# EAGLE design electrode (EAGLE 8.1.1)
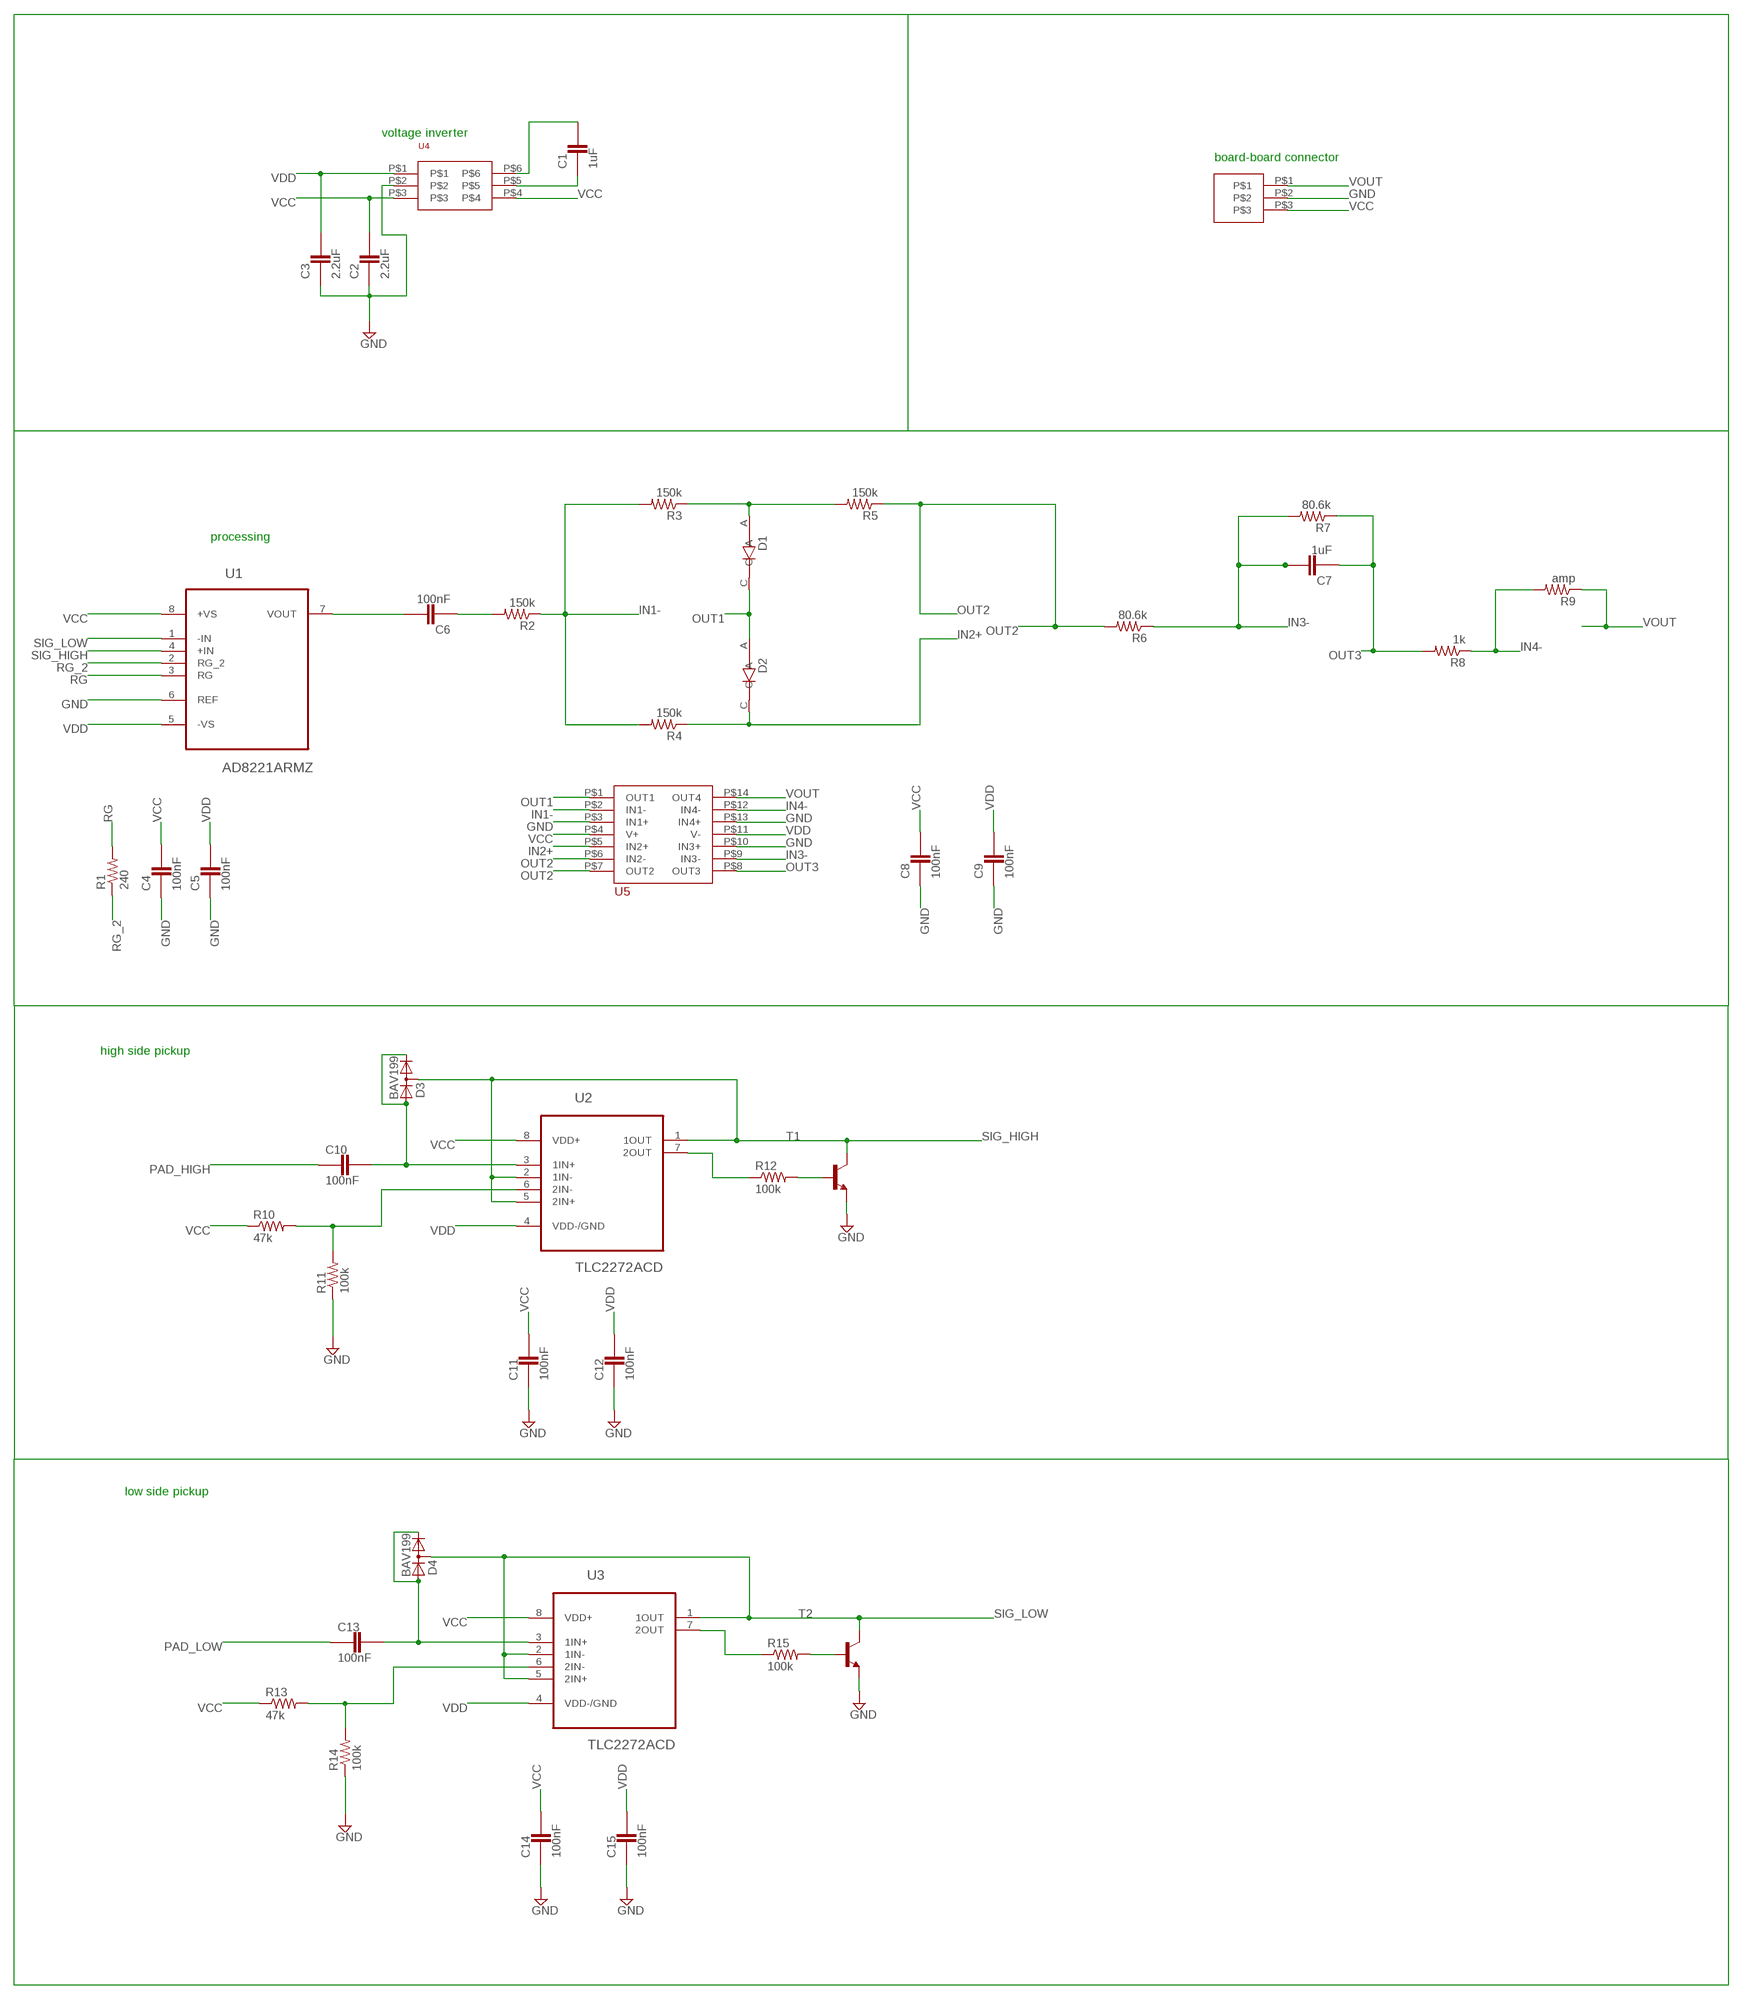
[diagram p0: schematic, sheet 1]

## Parts
C1  1uF  C0603C100C5GACTU  [C0603C100C5GACTU_CAPC1608X90]
C2  2.2uF  C0603C100C5GACTU  [C0603C100C5GACTU_CAPC1608X90]
C3  2.2uF  C0603C100C5GACTU  [C0603C100C5GACTU_CAPC1608X90]
C4  100nF  C0603C100C5GACTU  [C0603C100C5GACTU_CAPC1608X90]
C5  100nF  C0603C100C5GACTU  [C0603C100C5GACTU_CAPC1608X90]
C6  100nF  C0603C100C5GACTU  [C0603C100C5GACTU_CAPC1608X90]
C7  1uF  C0603C100C5GACTU  [C0603C100C5GACTU_CAPC1608X90]
C8  100nF  C0603C100C5GACTU  [C0603C100C5GACTU_CAPC1608X90]
C9  100nF  C0603C100C5GACTU  [C0603C100C5GACTU_CAPC1608X90]
C10  100nF  C0603C100C5GACTU  [C0603C100C5GACTU_CAPC1608X90]
C11  100nF  C0603C100C5GACTU  [C0603C100C5GACTU_CAPC1608X90]
C12  100nF  C0603C100C5GACTU  [C0603C100C5GACTU_CAPC1608X90]
C13  100nF  C0603C100C5GACTU  [C0603C100C5GACTU_CAPC1608X90]
C14  100nF  C0603C100C5GACTU  [C0603C100C5GACTU_CAPC1608X90]
C15  100nF  C0603C100C5GACTU  [C0603C100C5GACTU_CAPC1608X90]
D1  1N4148WS-7-F  [SOD2513X120N]
D2  1N4148WS-7-F  [SOD2513X120N]
D3  BAV199  [SOT23]
D4  BAV199  [SOT23]
R1  240  R-US_R0603  [R0603]
R2  150k  R-US_R0603  [R0603]
R3  150k  R-US_R0603  [R0603]
R4  150k  R-US_R0603  [R0603]
R5  150k  R-US_R0603  [R0603]
R6  80.6k  R-US_R0603  [R0603]
R7  80.6k  R-US_R0603  [R0603]
R8  1k  R-US_R0603  [R0603]
R9  amp  R-US_R0603  [R0603]
R10  47k  R-US_R0603  [R0603]
R11  100k  R-US_R0603  [R0603]
R12  100k  R-US_R0603  [R0603]
R13  47k  R-US_R0603  [R0603]
R14  100k  R-US_R0603  [R0603]
R15  100k  R-US_R0603  [R0603]
T1  MMBT2222ALT1-NPN-SOT23-BEC  [SOT23-BEC]
T2  MMBT2222ALT1-NPN-SOT23-BEC  [SOT23-BEC]
U1  AD8221ARMZ  [SOP65P490X110-8N]
U2  TLC2272ACD  [SOIC127P600X175-8N]
U3  TLC2272ACD  [SOIC127P600X175-8N]
U4  LM2776  [LM2776-SO]
U5  TL084  [TL084-TSSOP]
U$2  B3B-PH-SM4  [B3B-PH-SM4]

## Nets
CFLY+: C1.2 U4.P$5
CFLY-: C1.1 U4.P$6
GND: C2.2 C3.2 C4.2 C5.2 C8.2 C9.2 C11.2 C12.2 C14.2 C15.2 R11.1 R14.1 T1.E T2.E U1.6(REF) U4.P$2 U5.P$3(IN1+) U5.P$10(IN3+) U5.P$13(IN4+) U$2.P$2
IN1-: R2.1 R3.2 R4.2 U5.P$2(IN1-)
IN2+: D2.C R4.1 U5.P$5(IN2+)
IN3-: C7.1 R6.1 R7.2 U5.P$9(IN3-)
IN4-: R8.1 R9.2 U5.P$12(IN4-)
N$1: C6.1 U1.7(VOUT)
N$2: C6.2 R2.2
N$4: R13.2 R14.2 U3.6(2IN-)
N$5: D1.A R3.1 R5.2
N$6: C13.1 D4.1(A) D4.2(C) U3.3(1IN+)
N$7: R10.2 R11.2 U2.6(2IN-)
N$8: C10.1 D3.1(A) D3.2(C) U2.3(1IN+)
N$9: R12.1 U2.7(2OUT)
N$10: R12.2 T1.B
N$11: R15.1 U3.7(2OUT)
N$12: R15.2 T2.B
OUT1: D1.C D2.A U5.P$1(OUT1)
OUT2: R5.1 R6.2 U5.P$6(IN2-) U5.P$7(OUT2)
OUT3: C7.2 R7.1 R8.2 U5.P$8(OUT3)
PAD_HIGH: C10.2
PAD_LOW: C13.2
RG: R1.2 U1.3(RG)
RG_2: R1.1 U1.2(RG_2)
SIG_HIGH: D3.3(AC) T1.C U1.4(+IN) U2.1(1OUT) U2.2(1IN-) U2.5(2IN+)
SIG_LOW: D4.3(AC) T2.C U1.1(-IN) U3.1(1OUT) U3.2(1IN-) U3.5(2IN+)
VCC: C2.1 C4.1 C8.1 C11.1 C14.1 R10.1 R13.1 U1.8(+VS) U2.8(VDD+) U3.8(VDD+) U4.P$3 U4.P$4 U5.P$4(V+) U$2.P$3
VDD: C3.1 C5.1 C9.1 C12.1 C15.1 U1.5(-VS) U2.4(VDD-/GND) U3.4(VDD-/GND) U4.P$1 U5.P$11(V-)
VOUT: R9.1 U5.P$14(OUT4) U$2.P$1

## Notes on the sheet
- voltage inverter
- board-board connector
- processing
- high side pickup
- low side pickup

## Library data of the parts
C1-C15 = Common-Parts-Library-Eagle:C0603C100C5GACTU: Stock Cap 10pf 50v +/-0.25pf Np0(C0g) Smd-0603 Tr-7-Pa s; MANUFACTURER: KEMET
D1 D2 = Common-Parts-Library-Eagle:1N4148WS-7-F: 1N4148WS Series 2 A 75 V 200 mW Surface Mount Fast Switching Diode - SOD-323; MANUFACTURER: Diodes Inc.
D3 D4 = diode:BAV199: DIODE low-leakage double diode
R1-R15 = resistor:R-US_: RESISTOR, American symbol
T1 T2 = transistor:*-NPN-: NPN Transistror BF959 corrected 2008.03.06
U1 = AD8221ARMZ:AD8221ARMZ: Precision Instrumentation Amplifier; AVAILABILITY: Good; DESCRIPTION: Amplifier; Precision Instrumentation Amplifier, 8-Pin MSOP; MF: Analog Devices; MP: AD8221ARMZ; PACKAGE: MSOP-8 Analog Devices; PRICE: 3.99 USD
U2 U3 = TLC2272ACD:TLC2272ACD: OPERATIONAL AMPLIFIERS; AVAILABILITY: Good; DESCRIPTION: Advanced LinCMOS(TM) Rail-To-Rail Dual Operational Amplifier 8-SOIC; MF: Texas Instruments; MP: TLC2272ACD; PACKAGE: SOIC-8 Texas Instruments; PRICE: 1.29 USD
U4 = hands:LM2776
U5 = hands:TL084
U$2 = hands:B3B-PH-SM4

## Board
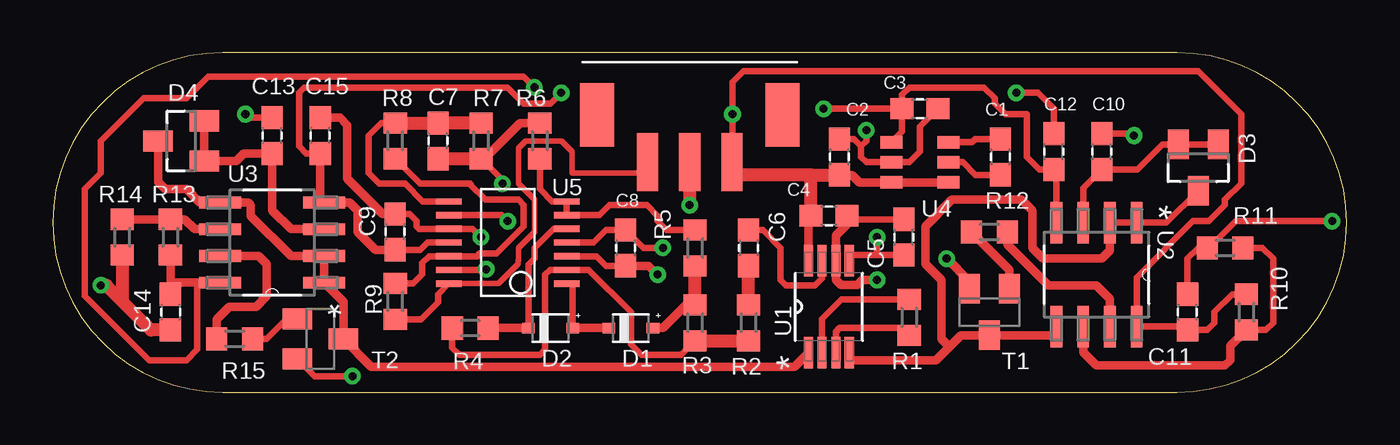
[diagram p1: board, top side]
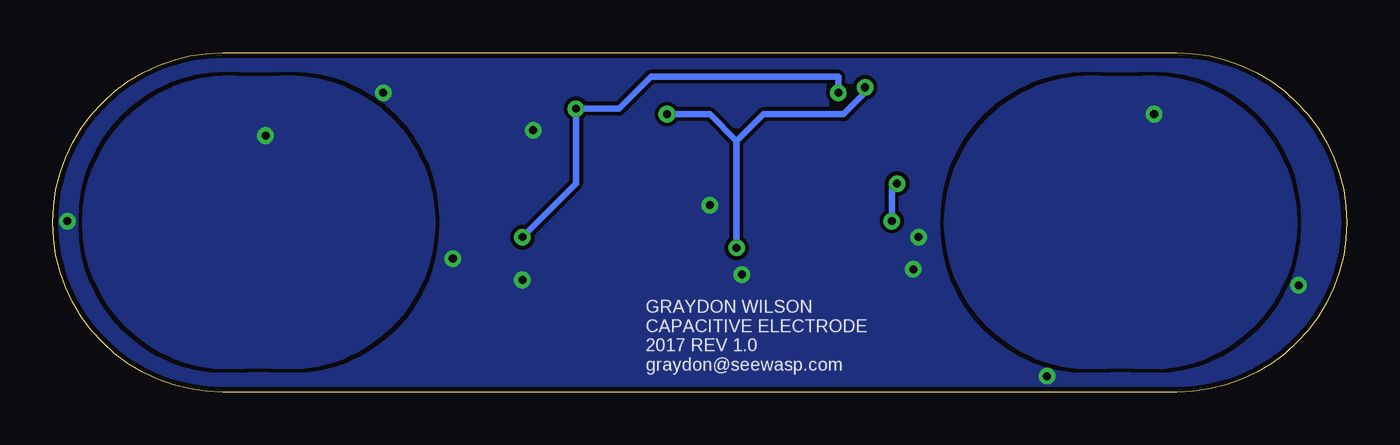
[diagram p2: board, bottom side, seen from below]

Size 61.4 x 16.13 mm. Coordinates in mm from the lower left corner, seen from the top.
Outline: 8.06,0 53.34,0 arc180 53.34,16.13 8.06,16.13 arc180 8.06,0
Copper layers (1*16): Top 0.035mm / dielectric 1.5mm / Bottom 0.035mm
Design rules "bac_student *": minimum track width 10mil, minimum drill 10mil, track to track 7mil, track to pad 7mil, pad to pad 7mil, via to via 7mil, smd to smd 7mil, copper to edge 10mil, drill to drill 8mil, minimum pad ring 10mil, minimum via ring 8mil, stop-mask expansion 4mil, vias tented up to drill 15mil, thermal gap 10mil

### Footprints (pad centres in the part's own frame; a part is rotated, then mirrored left to right if it is on the bottom)
C0603C100C5GACTU_CAPC1608X90 = smd 1.1 x 1: 1 -0.85,0; 2 0.85,0
SOD2513X120N = smd 0.6 x 0.5: A 1.05,0; C -1.05,0
SOT23 = smd 1 x 1.4: 1 -0.95,-1.1; 2 0.95,-1.1; 3 0,1.1
R0603 = smd 1 x 1.1: 1 -0.85,0; 2 0.85,0
SOT23-BEC = smd 1 x 1.4: B -0.95,-1.1; C 0,1.1; E 0.95,-1.1
SOP65P490X110-8N = smd 1.499 x 0.432: 1 -2.184,0.965; 2 -2.184,0.33; 3 -2.184,-0.33; 4 -2.184,-0.965; 5 2.184,-0.965; 6 2.184,-0.33; 7 2.184,0.33; 8 2.184,0.965
SOIC127P600X175-8N = smd 1.981 x 0.559: 1 -2.464,1.905; 2 -2.464,0.635; 3 -2.464,-0.635; 4 -2.464,-1.905; 5 2.464,-1.905; 6 2.464,-0.635; 7 2.464,0.635; 8 2.464,1.905
LM2776-SO = smd 1.05 x 0.6: P$1 -1.35,0.95; P$2 -1.35,0; P$3 -1.35,-0.95; P$4 1.35,-0.95; P$5 1.35,0; P$6 1.35,0.95
TL084-TSSOP = smd 0.3 x 1.2: P$1 -1.95,-2.8; P$2 -1.3,-2.8; P$3 -0.65,-2.8; P$4 0,-2.8; P$5 0.65,-2.8; P$6 1.3,-2.8; P$7 1.95,-2.8; P$8 1.95,2.8; P$9 1.3,2.8; P$10 0.65,2.8; P$11 0,2.8; P$12 -0.65,2.8; P$13 -1.3,2.8; P$14 -1.95,2.8
B3B-PH-SM4 = smd 1 x 2.75: P$1 -2,0; P$2 0,0; P$3 2,0 | smd 1.6 x 3: P$4 -4.4,2.25; P$5 4.4,2.25

### Placement (x,y rotation side)
C1  44.96,11.18 270 top
C2  37.34,11.18 90 top
C3  41.15,13.46 0 top
C4  36.83,8.38 0 top
C5  40.39,7.37 90 top
C6  33.02,6.86 270 top
C7  18.29,11.94 90 top
C8  27.18,6.86 270 top
C9  16.26,7.62 90 top
C10  49.78,11.43 90 top
C11  53.85,3.81 90 top
C12  47.5,11.43 90 top
C13  10.41,12.19 90 top
C14  5.59,3.81 270 top
C15  12.7,12.19 90 top
D1  27.43,3.05 0 top
D2  23.62,3.05 0 top
D3  54.36,10.67 180 top
D4  6.1,11.94 90 top
R1  40.64,3.56 270 top
R2  33.02,3.3 90 top
R3  30.48,3.3 270 top
R4  19.81,3.05 180 top
R5  30.48,6.86 270 top
R6  23.11,11.94 270 top
R7  20.32,11.94 270 top
R8  16.26,11.94 90 top
R9  16.26,4.32 90 top
R10  56.64,3.81 270 top
R11  55.63,6.86 0 top
R12  44.45,7.62 180 top
R13  5.59,7.37 90 top
R14  3.3,7.37 90 top
R15  8.64,2.54 0 top
T1  44.45,3.81 180 top
T2  12.7,2.54 270 top
U1  36.83,4.06 90 top
U2  49.53,5.59 270 top
U3  10.41,7.11 180 top
U4  41.15,10.92 0 top
U5  21.59,7.11 90 top
U$2  30.23,10.92 0 top

### Tracks (layer width: path | path; a pad name or v marks a point on that pad's centre or on a via)
CFLY+
  Top 0.305: U4.P$5 43.18,10.92 43.78,10.33 C1.2
CFLY-
  Top 0.305: C1.1 43.78,12.03 43.62,11.87 U4.P$6
GND  (via drill 0.38, 0.38 pad 0.61)
  Top 0.305: U5.P$3 25.8,6.46 26.25,6.01 C8.2 | C9.2 16.93,8.47 17.27,8.13 17.27,7.87 17.38,7.76 U5.P$10 19.92,7.76 v20.32,7.37 | U5.P$13 20.54,5.81 v20.57,5.84 | T2.E 12.43,0.76 v14.22,0.76 | C3.2 41.15,12.61 41.15,11.43 40.64,10.92 U4.P$2 38.61,10.92 38.35,11.18 38.35,11.68 | C2.2 38.01,12.03 38.35,11.68 | 38.61,12.19 v38.61,12.45 38.61,11.94 38.35,11.68 | C11.2 53.85,6.35 54.36,6.86 R11.1 54.86,6.86 56.13,8.13 v60.71,8.13 | C4.2 37.68,8.22 C5.2 | C12.2 47.5,13.46 46.74,14.22 v45.72,14.22
  Top 0.406: C4.2 37.68,7.96 37.16,7.44 U1.6 37.17,6.24 37.17,5.33 37.41,5.09 38.18,5.09 38.42,5.33 v39.12,5.33 | C9.2 15.66,8.47 13.97,10.16 13.97,12.7 13.63,13.04 C15.2 | C8.2 28.28,6.01 v28.7,5.59 | T1.E 43.5,5.27 v42.42,6.35
  Top 0.61: C14.2 4.66,2.96 3.3,4.32 | R14.1 3.3,4.32 | 3.3,4.32 2.54,5.08 v2.29,5.08 | U$2.P$2 v30.23,8.89
  pour Bottom (rank 2): -3.05,18.8 70.87,20.32 73.15,-5.59 -3.05,-6.1
IN1-
  Top 0.305: R4.2 18.96,2.12 19.3,1.78 23.11,1.78 23.37,2.03 23.37,5.59 23.59,5.81 U5.P$2 25.43,5.81 27.43,3.81 27.43,2.29 27.94,1.78 29.81,1.78 R3.2
  Top 0.61: R3.2 R2.1
IN2+
  Top 0.305: D2.C 22.57,6.06 22.86,6.35 22.86,6.86 23.76,7.76 U5.P$5
  Top 0.406: R4.1 D2.C
IN3-  (via drill 0.38)
  Top 0.305: U5.P$9 21.31,8.41 v21.59,8.13 | v21.34,9.91 21.34,10.07 R7.2
  Top 0.406: R6.1 22.19,12.79 20.49,11.09 R7.2
  Top 0.61: C7.1 R7.2
  Bottom 0.305: v21.59,8.13 21.59,9.65 v21.34,9.91
IN4-
  Top 0.305: R8.1 17.44,9.91 19.81,9.91 19.82,9.89 19.82,9.85 20.53,9.14 22.1,9.14 22.35,8.89 22.35,7.87 21.07,6.59 20.26,6.59 20.13,6.46 U5.P$12 17.85,6.46 17.53,6.14 17.53,5.59 17.11,5.17 R9.2
N$1
  Top 0.305: C6.1 33.69,7.71 34.54,6.86 34.54,5.33 34.8,5.08 36.16,5.08 36.5,5.42 U1.7
N$2
  Top 0.61: R2.2 C6.2
N$4
  Top 0.406: R14.2 R13.2 6.26,8.22 6.73,7.75 U3.6
N$5
  Top 0.406: D1.A 28.96,3.05 30.06,4.15 R3.1
  Top 0.61: R3.1 R5.2
N$6
  Top 0.406: U3.3 11.3,7.75 10.41,8.64 C13.1 9.06,11.34 8.7,10.99 D4.1 D4.2
N$7
  Top 0.305: R10.2 57.57,2.96 57.91,3.3 57.91,6.35 57.4,6.86 R11.2
  Top 0.406: U2.6 48.9,1.91 49.53,1.27 55.63,1.27 55.88,1.52 55.88,2.2 R10.2
N$8
  Top 0.305: U2.3 48.9,9.69 C10.1 51.47,10.58 52.66,11.77 D3.2 D3.1
N$9
  Top 0.406: R12.1 45.3,7.02 47.24,5.08 49.53,5.08 50.16,4.45 U2.7
N$10
  Top 0.406: T1.B 45.4,5.82 R12.2
N$11
  Top 0.406: R15.1 7.79,3.47 8.38,4.06 9.65,4.06 10.16,4.57 10.16,6.1 9.78,6.48 U3.7
N$12
  Top 0.305: R15.2 10.16,2.54 11.11,3.49 T2.B
OUT1
  Top 0.305: U5.P$1 24.67,5.16 D2.A
  Top 0.406: D2.A D1.C
OUT2
  Top 0.305: R5.1 29.12,7.71 28.7,8.13 28.7,8.38 28.19,8.89 26.42,8.89 25.94,8.41 U5.P$6 U5.P$7 23.7,9.06 23.11,9.65 R6.2
OUT3
  Top 0.305: R8.2 15.58,12.79 14.99,12.19 14.99,10.41 15.49,9.91 16.72,9.91 17.56,9.06 U5.P$8
  Top 0.61: R7.1 C7.2 R8.2
PAD_HIGH  (via drill 0.38 pad 0.61)
  Top 0.305: C10.2 51.31,12.28 v51.31,12.19
  pour Bottom: 57.02,8.06 arc180 43.43,8.06 arc180
  pour Bottom: 59.82,8.06 arc180 46.23,8.06 arc180
  pour Bottom: 50.23,14.86 53.02,14.86 53.02,1.27 50.23,1.27
PAD_LOW  (via drill 0.38 pad 0.61)
  Top 0.305: C13.2 9.31,13.04 v9.14,13.21
  pour Bottom: 2.54,8.06 arc180 16.13,8.06 arc180
  pour Bottom: 5.33,8.06 arc180 18.92,8.06 arc180
  pour Bottom: 9.33,14.86 12.13,14.86 12.13,1.27 9.33,1.27
  pour Bottom: 2.54,8.06 arc180 16.13,8.06 arc180
RG
  Top 0.305: U1.3 37.16,2.87 37.34,3.05 40.3,3.05 R1.2
RG_2
  Top 0.305: R1.1 37.43,4.41 36.5,3.48 U1.2
SIG_HIGH
  Top 0.305: 37.8,1.52 U1.4 | D3.3 52.84,8.05 U2.1 U2.2 | 47.62,2.71 U2.5
  Top 0.406: 42.55,2.16 43.1,2.71 T1.C 47.62,2.71 | 42.55,2.16 41.91,1.52 37.8,1.52 | U2.2 50.16,6.73 49.78,6.35 46.99,6.35 46.48,6.86 46.48,8.64 45.97,9.14 42.67,9.14 41.4,7.87 41.4,6.1 42.16,5.33 42.16,2.54 42.55,2.16
SIG_LOW
  Top 0.406: D4.3 5,9.99 5.33,9.65 6.35,9.65 6.99,9.02 U3.5 9.27,9.02 9.4,8.89 9.4,8.38 11.3,6.48 U3.2 U3.1 13.8,4.29 T2.C 15.12,1.22 35.2,1.22 U1.1
VCC  (via drill 0.38, 0.38 pad 0.61)
  Top 0.305: U5.P$4 25.65,7.11 26.25,7.71 C8.1 28.03,6.86 v28.96,6.86 | U$2.P$3 32.26,10.95 v32.26,13.21 32.26,14.73 32.77,15.24 54.36,15.24 56.39,13.21 56.39,9.91 55.63,9.14 55.63,8.89 54.86,8.13 54.1,8.13 51.44,5.46 U2.8 53.68,3.12 C11.1 54.78,2.96 55.12,3.3 55.12,3.81 55.97,4.66 R10.1 | 6.86,5.21 6.86,2.03 6.35,1.52 4.57,1.52 1.52,4.57 1.52,9.65 2.29,10.41 2.29,11.94 4.32,13.97 6.35,13.97 7.37,14.99 22.35,14.99 v22.86,14.48
  Top 0.406: U1.8 35.87,8.38 C4.1 | C2.1 37.93,10.33 38.29,9.97 U4.P$3 U4.P$4 | 5.59,5.21 C14.1 | 5.59,5.21 R13.1 | U3.8 6.86,5.21 5.59,5.21
  Top 0.61: 35.98,10.33 C2.1 | 35.98,10.33 32.23,10.33 U$2.P$3 | C4.1 35.98,10.33
  Bottom 0.305: v28.96,6.86 28.96,11.94 | 28.96,11.94 30.23,13.21 v32.26,13.21 | 28.96,11.94 27.69,13.21 23.88,13.21 22.86,14.22 v22.86,14.48
VDD  (via drill 0.38, 0.38 pad 0.61)
  Top 0.305: C9.1 17.44,6.77 17.78,7.11 U5.P$11 | C15.1 12.03,11.34 11.68,11.68 11.68,14.22 11.94,14.48 21.59,14.48 22.35,13.72 23.62,13.72 v24.13,14.22 | C3.1 v36.58,13.46 | U4.P$1 40.3,12.37 C3.1 | U2.4 47.62,10.45 C12.1 46.82,10.58 46.23,11.18 46.23,13.21 45.21,13.21 44.7,13.72 44.7,13.97 44.2,14.48 40.64,14.48 40.3,14.14 C3.1 | U1.5 37.8,6.52 39.12,6.52 | 39.12,6.52 C5.1 | v39.12,7.37 39.12,6.52
  Top 0.406: C9.1 15.33,6.77 14.48,7.62 14.48,8.64 14.1,9.02 U3.4 12.7,9.2 C15.1
  Bottom 0.305: v24.13,14.22 24.13,14.99 33.02,14.99 34.54,13.46 v36.58,13.46 36.58,9.91 v39.12,7.37
VOUT
  Top 0.254: U5.P$14 21.16,5.16 22.09,6.09 22.09,6.26 22.1,6.27 22.1,6.86 22.86,7.62 22.86,9.14 22.1,9.91 22.1,11.59 22.43,11.92 24.15,11.92 24.64,11.43 24.64,10.41 27.72,10.41 U$2.P$1
  Top 0.305: U5.P$14 18.27,4.65 18.27,4.26 17.48,3.47 R9.1

### Text on the board
bNames: GRAYDON WILSON / CAPACITIVE ELECTRODE / 2017 REV 1.0 / graydon@seewasp.com